# EAGLE design digAudio (EAGLE 6.5.0)
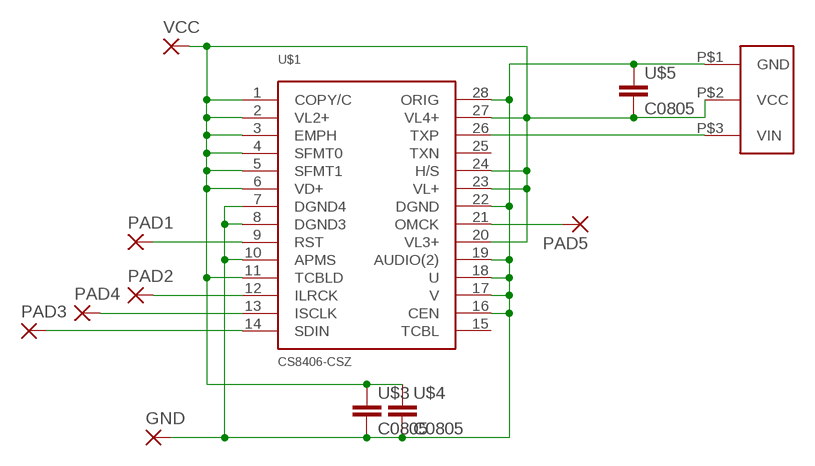
[diagram p0: schematic, sheet 1]

## Parts
GND  SMD2  [SMD1,27-2,54]
PAD1  SMD2  [SMD1,27-2,54]
PAD2  SMD2  [SMD1,27-2,54]
PAD3  SMD2  [SMD1,27-2,54]
PAD4  SMD2  [SMD1,27-2,54]
PAD5  SMD2  [SMD1,27-2,54]
U$1  CS8406-CSZ  [SO28W]
U$2  PHOTOLINK  [PHOTOLONK]
U$3  C0805  [Z0805]
U$4  C0805  [Z0805]
U$5  C0805  [Z0805]
VCC  SMD2  [SMD1,27-2,54]

## Nets
GND: GND.1(P) U$1.7(DGND4) U$1.8(DGND3) U$1.10(APMS) U$1.16(CEN) U$1.17(V) U$1.18(U) U$1.19(AUDIO(2)) U$1.22(DGND) U$1.28(ORIG) U$2.P$1(GND) U$3.2 U$4.2 U$5.1
N$1: U$1.26(TXP) U$2.P$3(VIN)
N$2: PAD1.1(P) U$1.9(RST)
N$3: PAD2.1(P) U$1.12(ILRCK)
N$4: PAD4.1(P) U$1.13(ISCLK)
N$5: PAD3.1(P) U$1.14(SDIN)
N$6: PAD5.1(P) U$1.21(OMCK)
VCC: U$1.1(COPY/C) U$1.2(VL2+) U$1.3(EMPH) U$1.4(SFMT0) U$1.5(SFMT1) U$1.6(VD+) U$1.11(TCBLD) U$1.20(VL3+) U$1.23(VL+) U$1.24(H/S) U$1.27(VL4+) U$2.P$2(VCC) U$3.1 U$4.1 U$5.2 VCC.1(P)
Unconnected: U$1.15(TCBL) U$1.25(TXN)

## Library data of the parts
GND PAD1-PAD5 VCC = wirepad:SMD2: SMD PAD
U$1 = cs8406:CS8406-CSZ
U$2 = cs8406:PHOTOLINK
U$3-U$5 = snescart:C0805

## Board
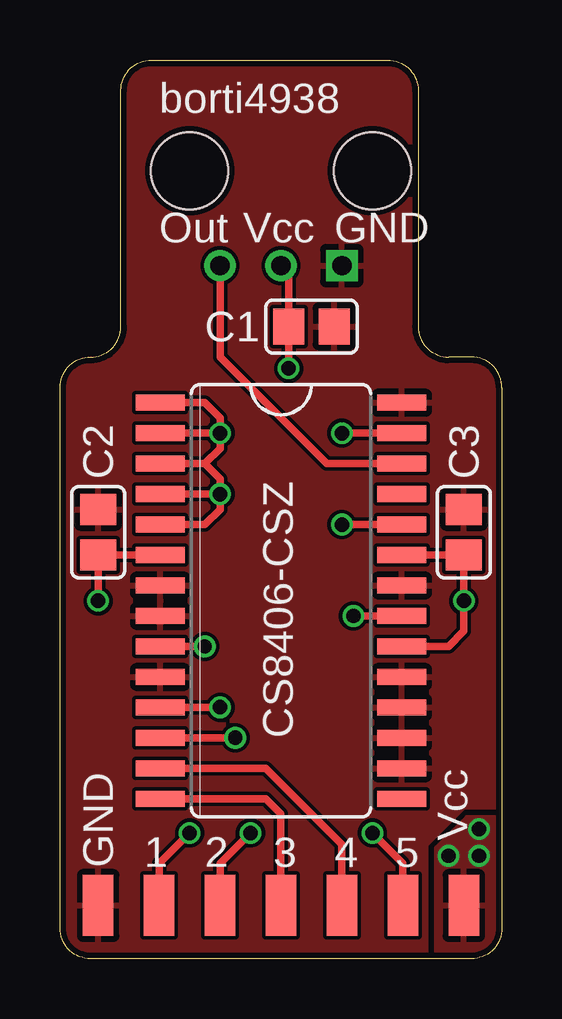
[diagram p1: board, top side]
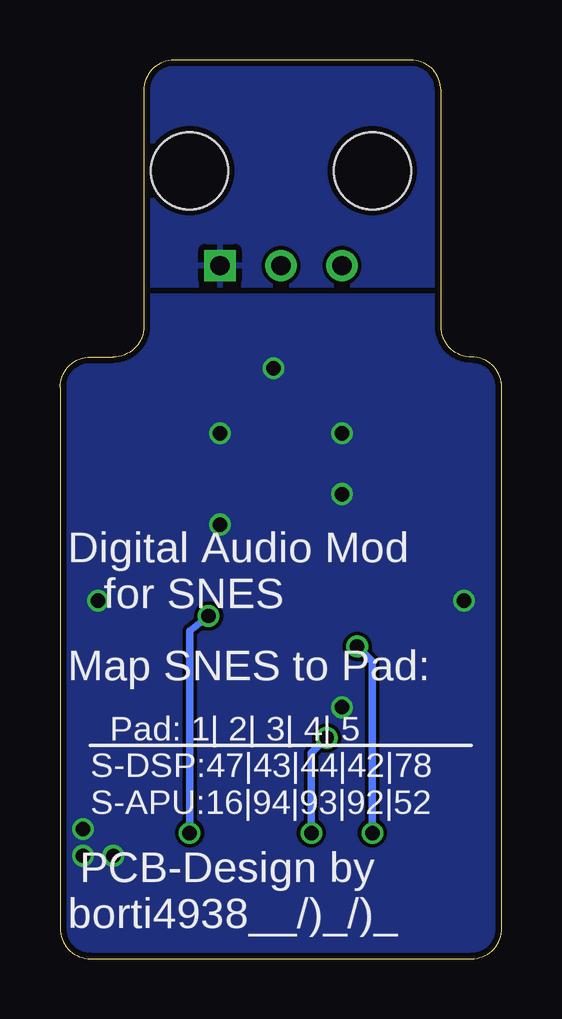
[diagram p2: board, bottom side, seen from below]

Size 18.41 x 37.46 mm. Coordinates in mm from the lower left corner, seen from the top.
Outline: 2.54,36.2 arc-90 3.81,37.46 13.65,37.46 arc-90 14.92,36.2 14.92,26.35 arc90 16.19,25.08 17.15,25.08 arc-90 18.42,23.81 18.42,1.27 arc-90 17.15,0 1.27,0 arc-90 0,1.27 0,23.81 arc-90 1.27,25.08 arc90 2.54,26.35 2.54,36.2
Copper layers (1*16): Top 0.035mm / dielectric 1.5mm / Bottom 0.035mm
Design rules "ITEADstudio_DRC": minimum track width 6mil, minimum drill 12mil, track to track 6mil, track to pad 6mil, pad to pad 6mil, via to via 6mil, smd to smd 0mil, copper to edge 10mil, drill to drill 10mil, minimum pad ring 10mil, minimum via ring 6mil, stop-mask expansion 2mil, vias tented up to drill 100mil, thermal gap 10mil

### Footprints (pad centres in the part's own frame; a part is rotated, then mirrored left to right if it is on the bottom)
SMD1,27-2,54 = smd 1.27 x 2.54: 1 0,0
SO28W = smd 0.66 x 2.032: 1 -6.985,-5.029; 2 -5.715,-5.029; 3 -4.445,-5.029; 4 -3.175,-5.029; 5 -1.905,-5.029; 6 -0.635,-5.029; 7 0.635,-5.029; 8 1.905,-5.029; 9 3.175,-5.029; 10 4.445,-5.029; 11 5.715,-5.029; 12 6.985,-5.029; 13 8.255,-5.029; 14 9.525,-5.029; 15 9.525,5.029; 16 8.255,5.029; 17 6.985,5.029; 18 5.715,5.029; 19 4.445,5.029; 20 3.175,5.029; 21 1.905,5.029; 22 0.635,5.029; 23 -0.635,5.029; 24 -1.905,5.029; 25 -3.175,5.029; 26 -4.445,5.029; 27 -5.715,5.029; 28 -6.985,5.029
PHOTOLONK = drill 0.8 square: P$1 2.54,0 | drill 0.8: P$2 0,0; P$3 -2.54,0 | hole 3.2: -3.81,3.95; 3.81,3.95
Z0805 = smd 1.3 x 1.5: 1 -0.95,0; 2 0.95,0

### Placement (x,y rotation side)
GND  1.59,2.22 0 top
PAD1  4.13,2.22 0 top
PAD2  6.67,2.22 0 top
PAD3  9.21,2.22 0 top
PAD4  11.75,2.22 0 top
PAD5  14.29,2.22 0 top
U$1  9.21,16.19 270 top
U$2  9.21,28.89 0 top
U$3  1.59,17.78 90 top
U$4  16.83,17.78 90 top
U$5  10.48,26.35 180 top
VCC  16.83,2.22 0 top

### Tracks (layer width: path | path; a pad name or v marks a point on that pad's centre or on a via)
GND
  pour Top: -7.3,-5.4 15.24,-5.4 15.24,4.76 16.83,6.35 26.99,6.35 26.99,37.78 -7.3,37.78
  pour Bottom: -7.3,37.78 26.99,37.78 26.99,28.1 -7.3,28.1
N$1
  Top 0.305: U$1.26 11.11,20.64 6.67,25.08 U$2.P$3
N$2  (via drill 0.6)
  Top 0.305: PAD1.1 4.13,3.97 v5.4,5.24 | v6.03,13.02 U$1.9
  Bottom 0.305: v5.4,5.24 5.4,12.38 v6.03,13.02
N$3  (via drill 0.6)
  Top 0.305: PAD2.1 6.67,3.97 v7.94,5.24 | v7.3,9.21 U$1.12
  Bottom 0.305: v7.94,5.24 7.94,8.57 v7.3,9.21
N$4
  Top 0.305: U$1.13 8.57,7.94 11.75,4.76 PAD4.1
N$5
  Top 0.305: U$1.14 8.57,6.67 9.21,6.03 PAD3.1
N$6  (via drill 0.6)
  Top 0.305: PAD5.1 14.29,3.97 v13.02,5.24 | v12.22,14.29 U$1.21
  Bottom 0.305: v13.02,5.24 13.02,13.65 v12.22,14.29
VCC  (via drill 0.6)
  Top 0.305: U$2.P$2 9.53,28.57 U$5.2 v9.53,24.61 | U$1.11 v6.67,10.48 | U$1.4 v6.67,19.37 | U$1.3 6.03,20.64 | 6.03,20.64 6.67,20 v6.67,19.37 | U$1.5 6.03,18.1 6.67,18.73 v6.67,19.37 | U$1.24 v11.75,18.1 | v11.75,21.91 U$1.27 | U$1.23 U$4.1 v16.83,14.92 16.83,13.65 16.19,13.02 U$1.20 | U$1.2 v6.67,21.91 | v6.67,21.91 6.67,21.27 6.03,20.64 | U$1.1 6.03,23.18 6.67,22.54 v6.67,21.91 | v1.59,14.92 U$3.1 U$1.6
  other vias: 17.46,5.4 17.46,4.29 16.19,4.29
  pour Bottom: -7.3,-5.4 26.99,-5.4 26.99,27.62 -7.3,27.62
  pour Top: 15.72,-0.32 15.72,4.6 16.99,5.87 19.37,5.87 19.37,-0.32

### Text on the board
tNames: borti4938 | Out | Vcc | GND | C1 | C2 | C3 | Vcc | GND | 1 | 2 | 3 | 4 | 5
bNames: Digital Audio Mod / for SNES | Map SNES to Pad: | Pad: 1| 2| 3| 4| 5 / S-DSP:47|43|44|42|78 / S-APU:16|94|93|92|52 | PCB-Design by / borti4938__/)_/)_